# EasyEDA Pro project ProPrj_药盒0.11_2025-04-15.epro, schematic mini-ESP8266-Y12
Board Name: mini-ESP8266-Y12; Create Date: 2025-03-07; Page Name: Sheet_1; Project Name: 8266; Schematic Name: mini-ESP8266-Y12; Update Date: 2025-03-07; Add into BOM: yes; Company: 有岳十二; Convert to PCB: yes; Date: 2024-10-28; Draw By: wy506787744; REV: 1.0; Sheet: 1/1
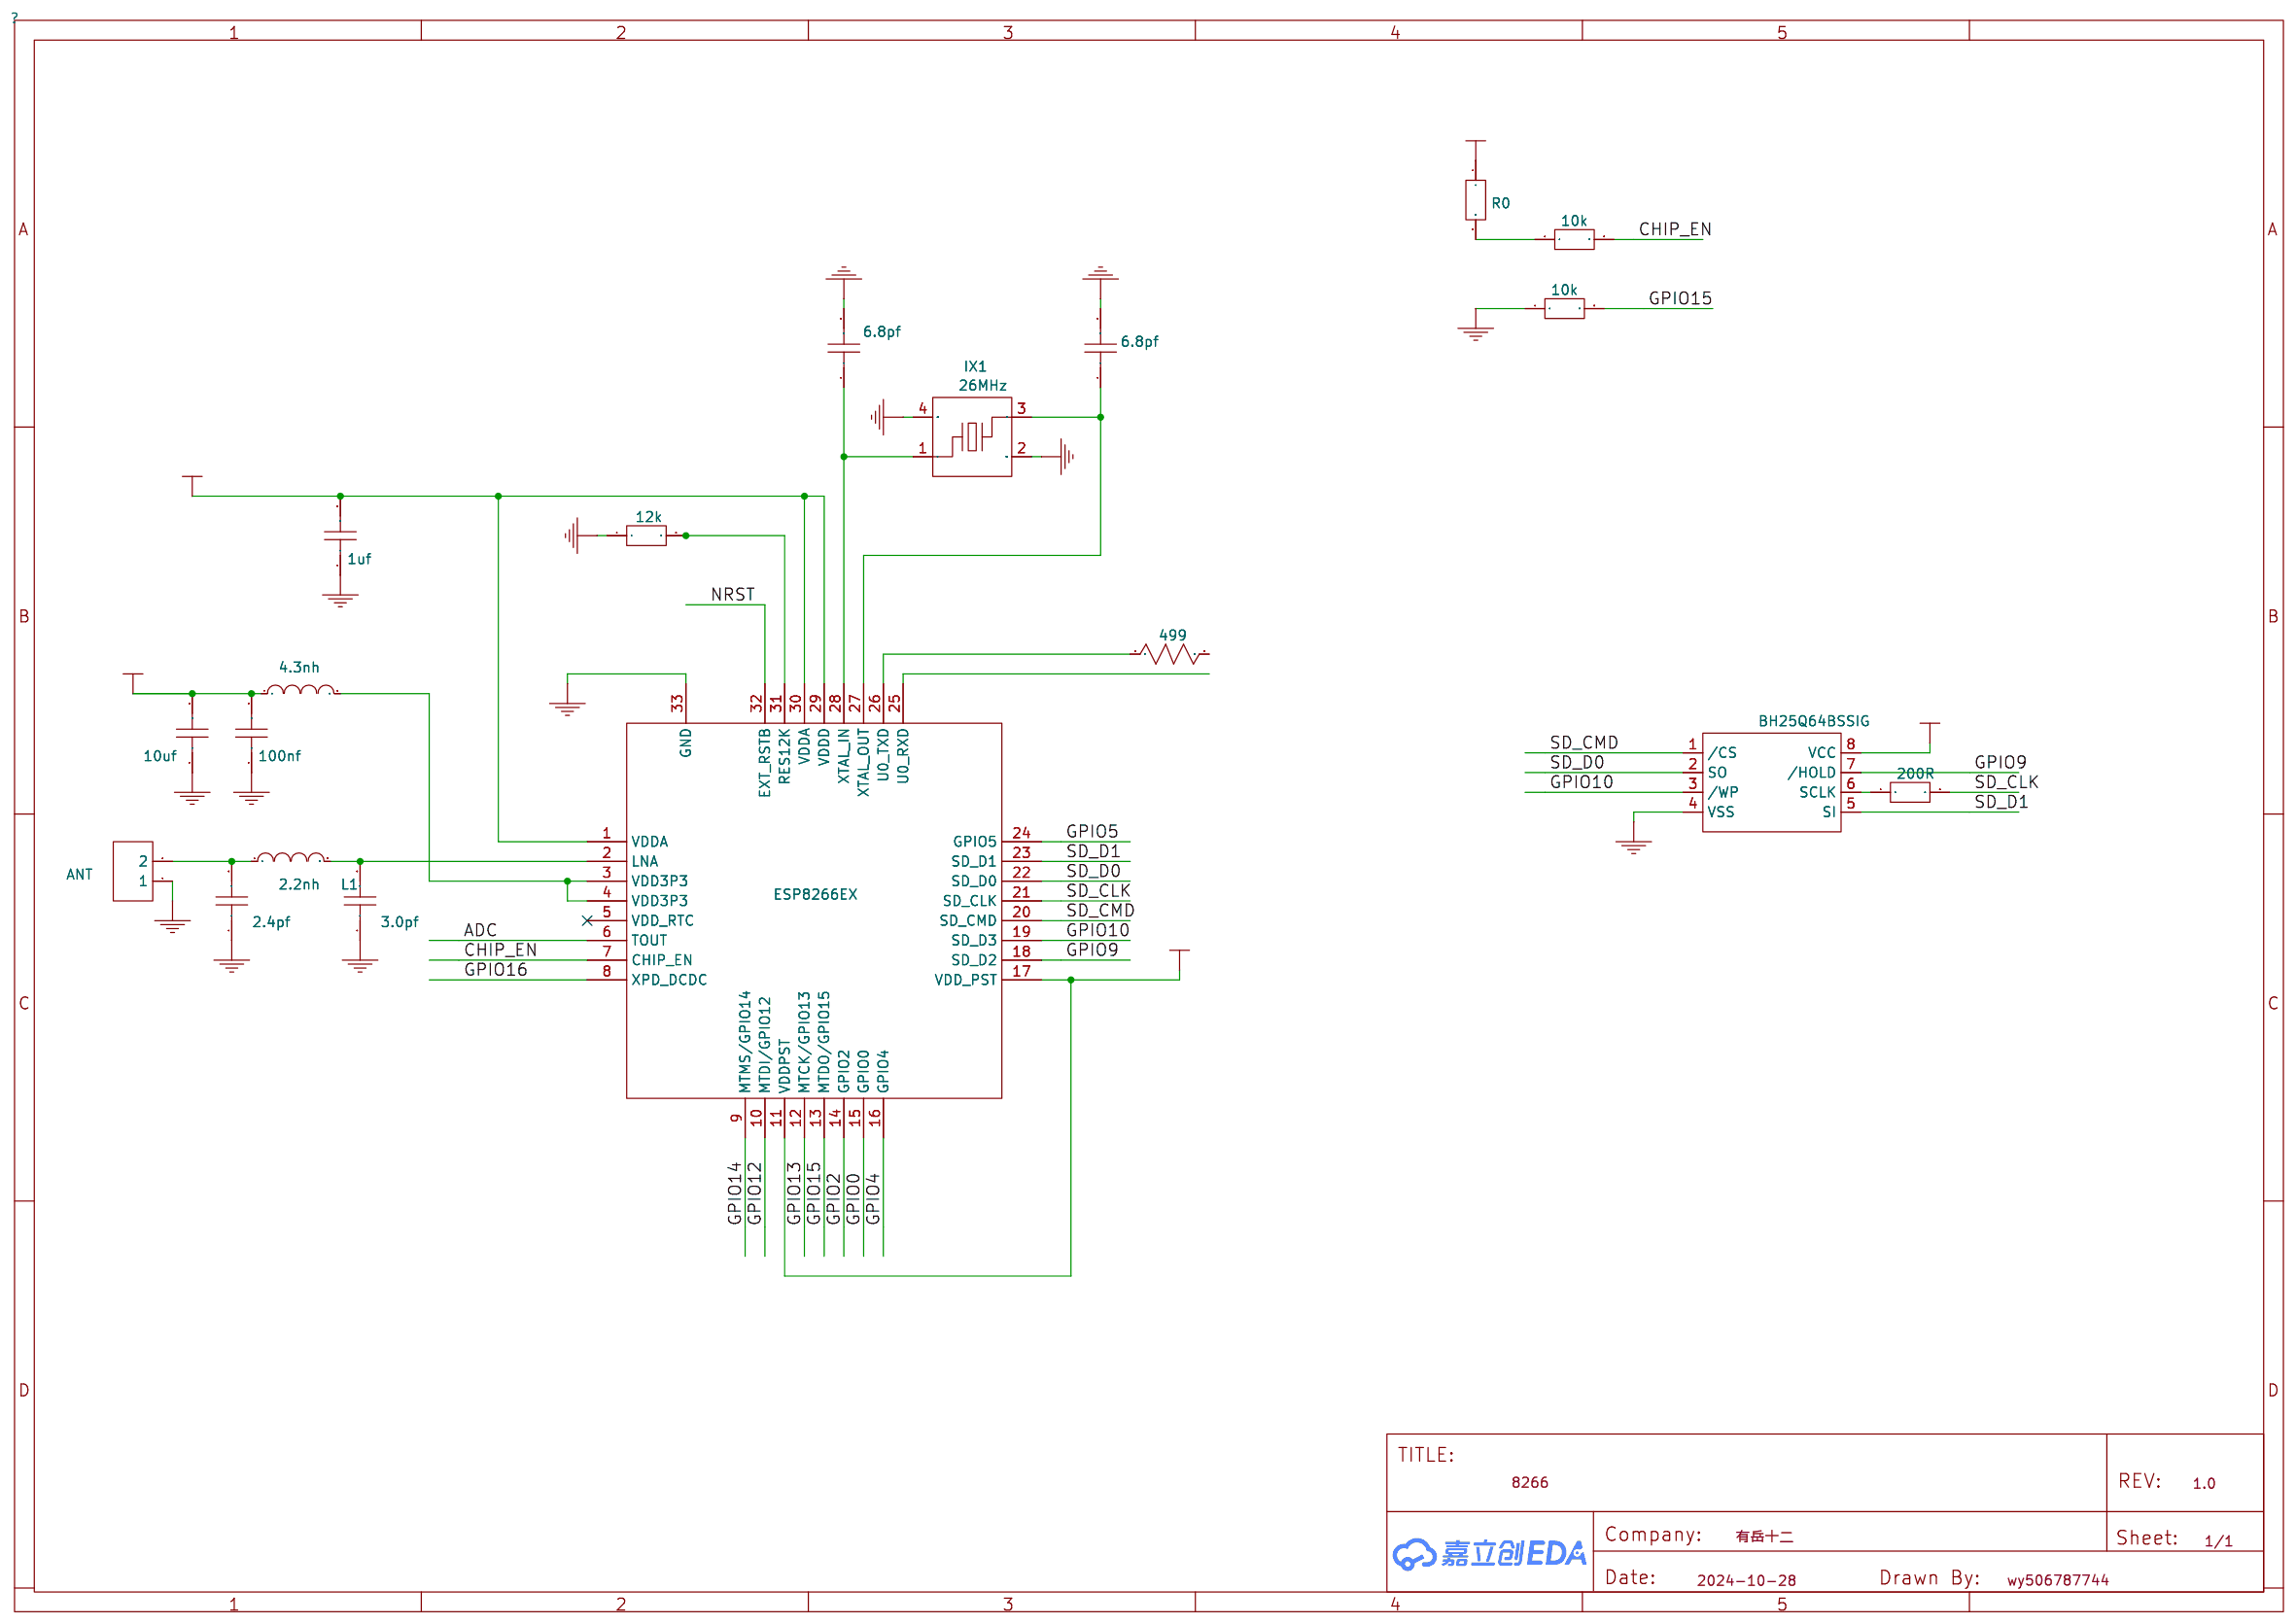
[diagram p0: schematic sheet]

## Parts
ANT  HDR-F-2.54_1x2
IC3  1uf  [C0603]
IC4  100nf  [C0603]
IC5  10uf  [C0603]
IC6  3.0pf  [C0603]
IC7  6.8pf  [C0603]
IC8  6.8pf  [C0603]
IC9  2.4pf  [C0603]
IR1  12k  [R0603]
IR3  10k  [R0603]
IR7  10k  [R0603]
IR8  200R  [R0603]
IU1  ESP8266EX
IU2  BH25Q64BSSIG
IX1  26MHz
L1  2.2nh  [L0603]
L2  4.3nh  [L0603]
R1  499  [R0603]
R2  R0  [R0603]

## Library data of the parts
ANT = HDR-F-2.54_1x2: Supplier Part: C49661; Supplier: LCSC
IC3 = 1uf
IC4 = 100nf
IC5 = 10uf
IC6 = 3.0pf
IC7 IC8 = 6.8pf
IC9 = 2.4pf
IR1 = 12k
IR3 IR7 = 10k
IR8 = 200R
IU1 = ESP8266EX: Supplier: LCSC; Manufacturer: ESPRESSIF; image: //image.lceda.cn/szlcsc/C77967.jpg; Supplier Part: C77967; JLCPCB Part Class: Extend; JLCPCB SMD: Yes
IU2 = BH25Q64BSSIG: Supplier: LCSC; Supplier Part: C691572; Manufacturer: 华虹挚芯
IX1 = 26MHz: Supplier: LCSC; Supplier Part: C718673; Manufacturer: Suzhou Liming Elec; Manufacturer Part: 3225-26.00-9-10-10/A
L1 = 2.2nh
L2 = 4.3nh
R1 = 499
R2 = R0

## Nets
3V3: IC3.2 IC4.2 IC5.2 IU1.1(VDDA) IU1.11(VDDPST) IU1.17(VDD_PST) IU1.29(VDDD) IU1.30(VDDA) IU2.8(VCC) L2.1 R2.1
GND: ANT.1 IC3.1 IC4.1 IC5.1 IC6.1 IC7.2 IC8.2 IC9.1 IR1.1 IR7.1 IU1.33(GND) IU2.4(VSS) IX1.2(GND) IX1.4(GND)
ADC: IU1.6(TOUT)
CHIP_EN: IR3.2 IU1.7(CHIP_EN)
GPIO0: IU1.15(GPIO0)
GPIO2: IU1.14(GPIO2)
GPIO4: IU1.16(GPIO4)
GPIO5: IU1.24(GPIO5)
GPIO9: IU1.18(SD_D2) IU2.7(/HOLD)
GPIO10: IU1.19(SD_D3) IU2.3(/WP)
GPIO12: IU1.10(MTDI/GPIO12)
GPIO13: IU1.12(MTCK/GPIO13)
GPIO14: IU1.9(MTMS/GPIO14)
GPIO15: IR7.2 IU1.13(MTDO/GPIO15)
GPIO16: IU1.8(XPD_DCDC)
NRST: IU1.32(EXT_RSTB)
SD_CLK: IR8.2 IU1.21(SD_CLK)
SD_CMD: IU1.20(SD_CMD) IU2.1(/CS)
SD_D0: IU1.22(SD_D0) IU2.2(SO)
SD_D1: IU1.23(SD_D1) IU2.5(SI)
Net-(ANT-2): ANT.2 IC9.2 L1.1
Net-(IC6-2): IC6.2 IU1.2(LNA) L1.2
Net-(IC7-1): IC7.1 IU1.28(XTAL_IN) IX1.1
Net-(IC8-1): IC8.1 IU1.27(XTAL_OUT) IX1.3
Net-(IR1-2): IR1.2 IU1.31(RES12K)
Net-(IR3-1): IR3.1 R2.2
Net-(IR8-1): IR8.1 IU2.6(SCLK)
Net-(IU1-3): IU1.3(VDD3P3) IU1.4(VDD3P3) L2.2
Net-(IU1-26): IU1.26(U0_TXD) R1.1

Not connected (* = marked no-connect by the designer): IU1 5(VDD_RTC)* 25(U0_RXD); R1 2
